# EAGLE design MCU (EAGLE 9.6.0)
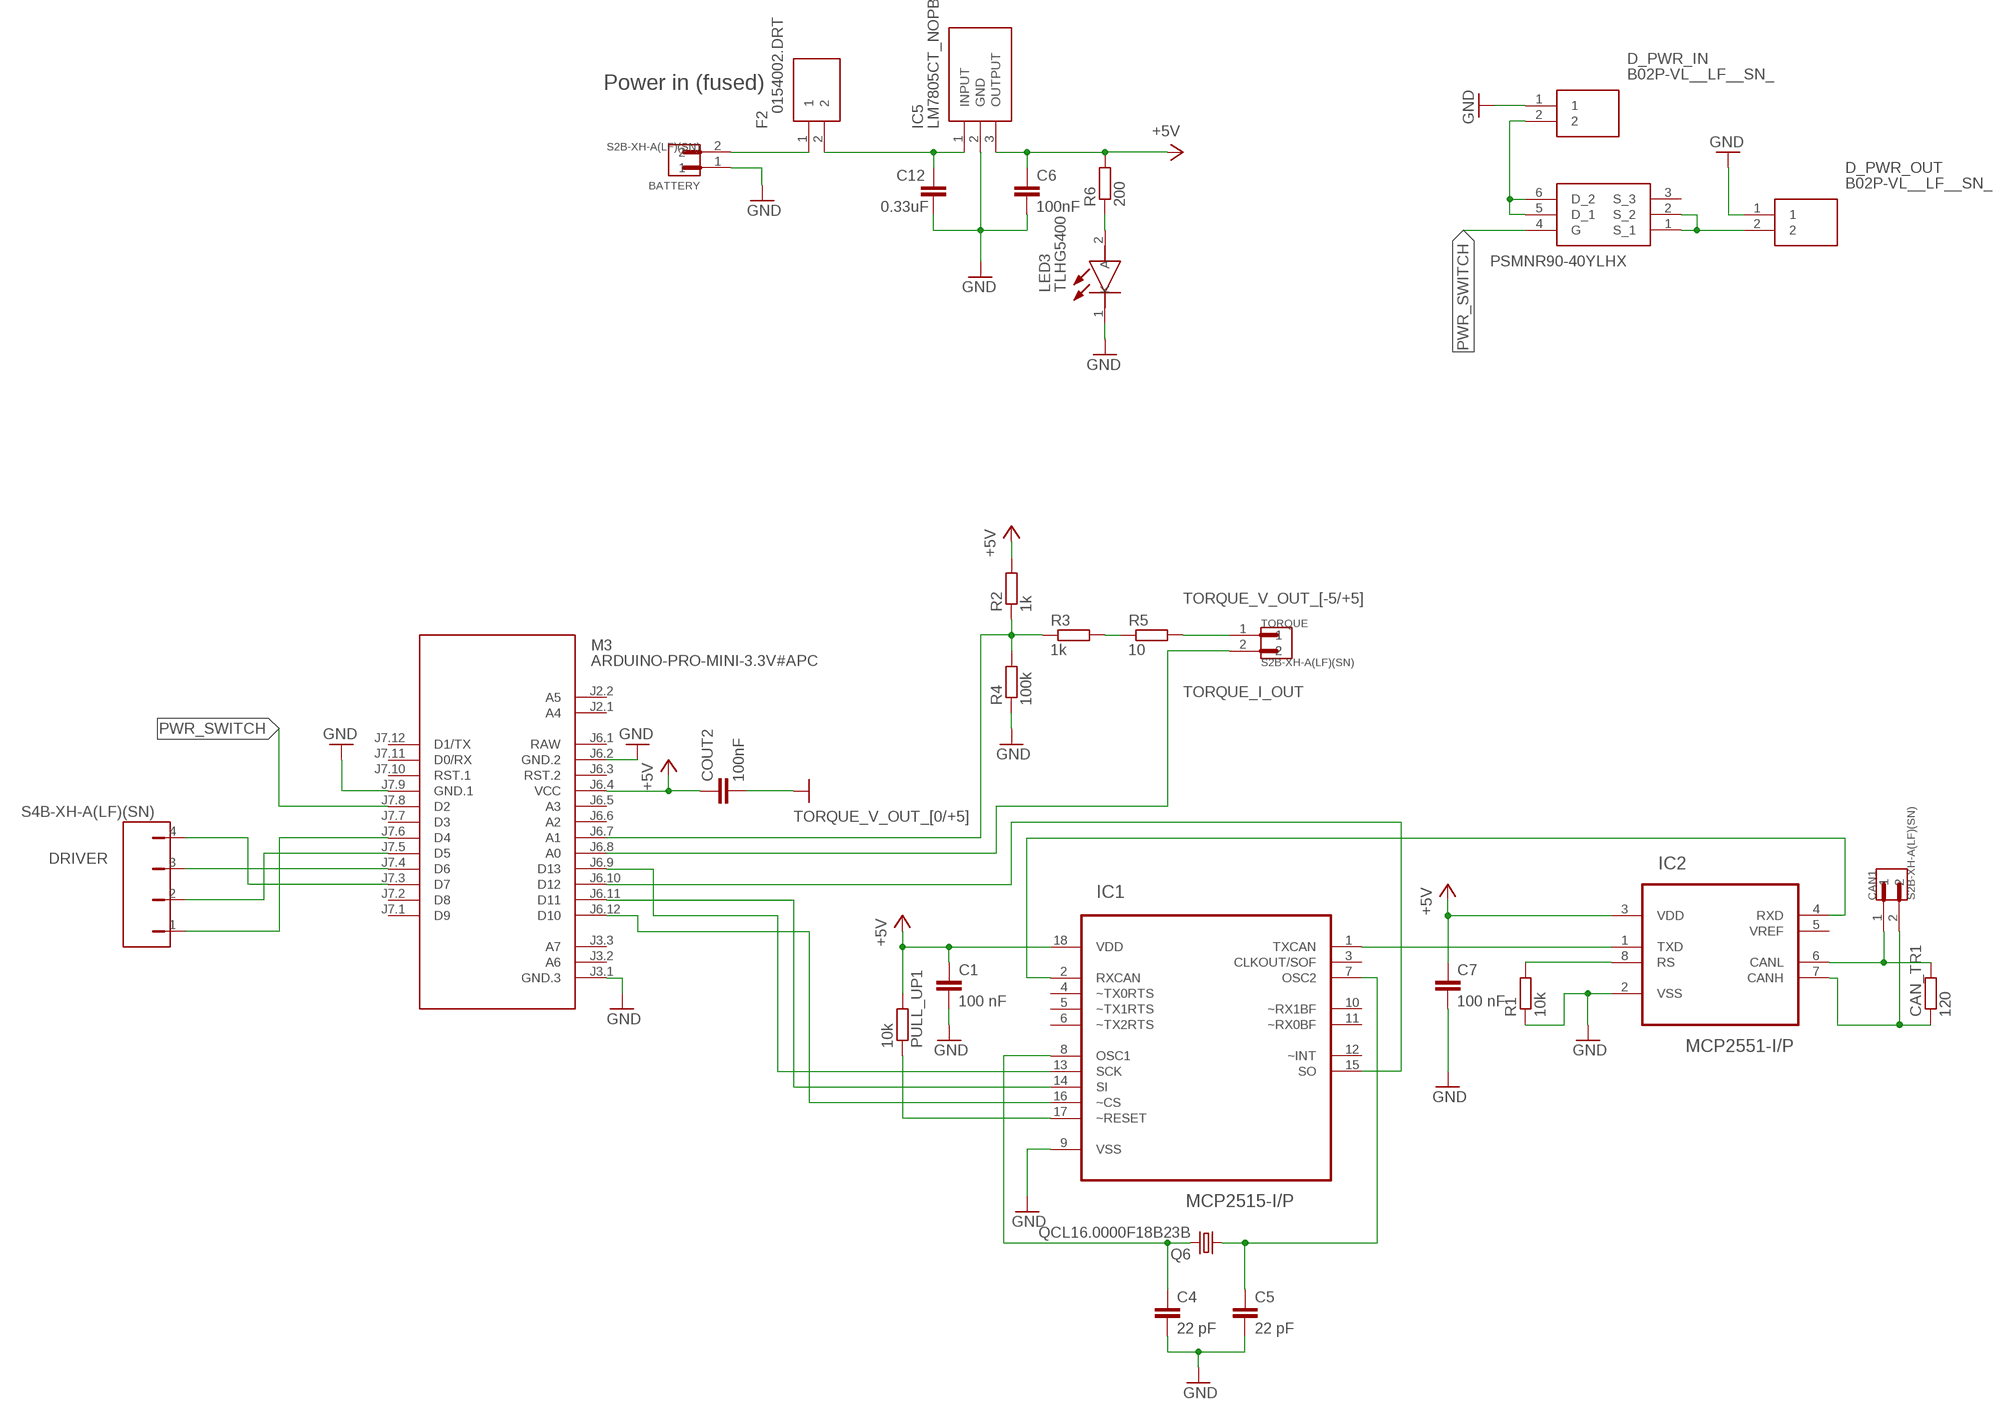
[diagram p0: schematic, sheet 1]

## Parts
BATTERY  S2B-XH-A(LF)(SN)  [JST_S2B-XH-A(LF)(SN)]
C1  100 nF  C-EUC0805  [C0805]
C4  22 pF  C-EUC0805  [C0805]
C5  22 pF  C-EUC0805  [C0805]
C6  100nF  C-EUC0805  [C0805]
C7  100 nF  C-EUC0805  [C0805]
C12  0.33uF  C-EUC0805  [C0805]
CAN1  S2B-XH-A(LF)(SN)  [JST_S2B-XH-A(LF)(SN)]
CAN_TR1  120  R-EU_R0805  [R0805]
COUT2  100nF  C-EUC0805  [C0805]
D_PWR_IN  B02P-VL__LF__SN_  [SHDR2W180P0X620_1X2_1340X1320X]
D_PWR_OUT  B02P-VL__LF__SN_  [SHDR2W180P0X620_1X2_1340X1320X]
DRIVER  S4B-XH-A(LF)(SN)  [S4B-XH-A(LF)(SN)]
F2  0154002.DRT  [FUSM9750X381N]
IC1  MCP2515-I/P  [DIP254P762X432-18]
IC2  MCP2551-I/P  [DIP254P762X432-8]
IC5  LM7805CT_NOPB  [TO254P470X1028X1955-3P]
LED3  TLHG5400  [TLHG5400]
M3  ARDUINO-PRO-MINI-3.3V#APC  [ARDUINO-PRO-MINI#APC]
PULL_UP1  10k  R-EU_R0805  [R0805]
Q1  PSMNR90-40YLHX  [PSMNR9040YLHX]
Q6  QCL16.0000F18B23B  CRYSTALHC49S  [HC49/S]
R1  10k  R-EU_R0805  [R0805]
R2  1k  R-EU_R0805  [R0805]
R3  1k  R-EU_R0805  [R0805]
R4  100k  R-EU_R0805  [R0805]
R5  10  R-EU_R0805  [R0805]
R6  200  R-EU_R0805  [R0805]
TORQUE  S2B-XH-A(LF)(SN)  [JST_S2B-XH-A(LF)(SN)]

## Nets
+5V [signal]: C1.1 C6.1 C7.1 COUT2.1 IC1.18(VDD) IC2.3(VDD) IC5.3(OUTPUT) M3.J6.4(VCC) PULL_UP1.2 R2.2 R6.2
CANH1: CAN1.1 CAN_TR1.2 IC2.6(CANL)
CANL1: CAN1.2 CAN_TR1.1 IC2.7(CANH)
DRAIN [Driver Power]: D_PWR_IN.2 Q1.5(D_1) Q1.6(D_2)
GND: BATTERY.1 C1.2 C4.2 C5.2 C6.2 C7.2 C12.2 COUT2.2 D_PWR_IN.1 D_PWR_OUT.1 IC1.9(VSS) IC2.2(VSS) IC5.2(GND) LED3.1(K) M3.J3.1(GND.3) M3.J6.2(GND.2) M3.J7.9(GND.1) R1.1 R4.1
N$1: DRIVER.4 M3.J7.3(D7)
N$3: DRIVER.2 M3.J7.5(D5)
N$4: C5.1 IC1.7(OSC2) Q6.1
N$8: DRIVER.3 M3.J7.4(D6)
N$9 [signal]: IC1.17(~RESET) PULL_UP1.1
N$11: DRIVER.1 M3.J7.6(D4)
N$16: R3.2 R5.1
N$18: BATTERY.2 F2.1
N$21: LED3.2(A) R6.1
N$24: C12.1 F2.2 IC5.1(INPUT)
N$32: IC1.1(TXCAN) IC2.1(TXD)
N$33: IC1.2(RXCAN) IC2.4(RXD)
N$34: C4.1 IC1.8(OSC1) Q6.2
N$37: IC2.8(RS) R1.2
N$61: IC1.15(SO) M3.J6.10(D12)
N$62: IC1.14(SI) M3.J6.11(D11)
N$63: IC1.16(~CS) M3.J6.12(D10)
N$64: IC1.13(SCK) M3.J6.9(D13)
PWR_SWITCH: M3.J7.8(D2) Q1.4(G)
SOURCE [Driver Power]: D_PWR_OUT.2 Q1.1(S_1) Q1.2(S_2)
TORQUE_I_OUT: M3.J6.8(A0) TORQUE.2
TORQUE_V_OUT_[0/+5]: M3.J6.7(A1) R2.1 R3.1 R4.2
TORQUE_V_OUT_[-5/+5]: R5.2 TORQUE.1
Unconnected: IC1.3(CLKOUT/SOF) IC1.4(~TX0RTS) IC1.5(~TX1RTS) IC1.6(~TX2RTS) IC1.10(~RX1BF) IC1.11(~RX0BF) IC1.12(~INT) IC2.5(VREF) M3.J2.1(A4) M3.J2.2(A5) M3.J3.2(A6) M3.J3.3(A7) M3.J6.3(RST.2) M3.J6.5(A3) M3.J6.6(A2) M3.J7.1(D9) M3.J7.2(D8) M3.J7.7(D3) M3.J7.10(RST.1) M3.J7.11(D0/RX) M3.J7.12(D1/TX) Q1.3(S_3)

## Notes on the sheet
- Power in (fused)

## Power pins joined to a net without a drawn wire
RAW: M3.J6.1(RAW)

## Library data of the parts
BATTERY CAN1 TORQUE = S2B-XH-A_LF__SN_:S2B-XH-A(LF)(SN): XH Series 2.5mm 2 Position Through Hole Shrouded Header Connector; DESCRIPTION: Connector Header Through Hole, Right Angle 2 position 0.098 _2.50mm_; DIGI-KEY_PART_NUMBER: 455-2257-ND; DIGI-KEY_PURCHASE_URL: https://www.digikey.com/product-detail/en/jst-sales-america-inc/S2B-XH-A_LF__SN_/455-2257-ND/1651055?utm_source=snapeda&utm_medium=aggregator&utm_campaign=symbol; MF: JST Sales; MP: S2B-XH-A_LF__SN_; PACKAGE: None
C1 C4-C7 C12 COUT2 = rcl:C-EU: CAPACITOR, European symbol; SPICEPREFIX: C
CAN_TR1 PULL_UP1 R1-R6 = rcl:R-EU_: RESISTOR, European symbol; SPICEPREFIX: R
D_PWR_IN D_PWR_OUT = B02P-VL__LF__SN_:B02P-VL__LF__SN_: JST VL Series, Series Number B02P, 6.2mm Pitch 2 Way 1 Row Straight PCB Header, Through Hole Termination, 20A Source: Datasheet <http://uk.rs-online.com/web/p/products/8201093P>; DESCRIPTION: JST VL Series, Series Number B02P, 6.2mm Pitch 2 Way 1 Row Straight PCB Header, Through Hole Termination, 20A; HEIGHT: 16.4mm; MANUFACTURER_NAME: JST (JAPAN SOLDERLESS TERMINALS); MANUFACTURER_PART_NUMBER: B02P-VL (LF)(SN); RS_PART_NUMBER: 8201093P; RS_PRICE-STOCK: http://uk.rs-online.com/web/p/products/8201093P
DRIVER = S4B-XH-A_LF__SN_:S4B-XH-A(LF)(SN): http://octopart.com/s4b-xh-a%28lf%29%28sn%29-jst-7995347; AVAILABILITY: Unavailable; DESCRIPTION: Connector Header Through Hole, Right Angle 4 position 0.098 _2.50mm_; MF: JST Sales; MP: S4B-XH-A_LF__SN_; PACKAGE: None; PRICE: None
F2 = 0154002.DRT:0154002.DRT: Littelfuse 2A T Surface Mount Fuse, 125V ac/dc Source: Datasheet; DESCRIPTION: Littelfuse 2A T Surface Mount Fuse, 125V ac/dc; HEIGHT: 3.81mm; MANUFACTURER_NAME: LITTELFUSE; MANUFACTURER_PART_NUMBER: 0154002.DRT; MOUSER_PART_NUMBER: 576-0154002.DRT; MOUSER_PRICE-STOCK: https://www.mouser.co.uk/ProductDetail/Littelfuse/0154002DRT?qs=2VFNtWizgicDQ8R7JxIsmA%3D%3D
IC1 = MCP2515-I_P:MCP2515-I/P: Stand-Alone CAN Controller; AVAILABILITY: Unavailable; DESCRIPTION: MCP2515 Series 5.5 V 1 Mb/s Stand Alone SPI Interface CAN Controller - PDIP-18; MF: Microchip; MP: MCP2515-I/P; PACKAGE: DIP-18 Microchip; PRICE: None
IC2 = MCP2551-I_P:MCP2551-I/P: High-Speed CAN Transceiver; AVAILABILITY: Unavailable; DESCRIPTION: MCP2551 Series 5.5 V 1 Mb/s Surface Mount High-Speed CAN Transceiver - PDIP-8; MF: Microchip; MP: MCP2551-I/P; PACKAGE: DIP-8 Microchip; PRICE: None
IC5 = LM7805CT_NOPB:LM7805CT_NOPB: 1.5-A, Wide VIN Fixed Voltage Regulators Source: Datasheet <http://www.ti.com/lit/gpn/lm7800>; DESCRIPTION: 1.5-A, Wide VIN Fixed Voltage Regulators; HEIGHT: 4.7mm; MANUFACTURER_NAME: Texas Instruments; MANUFACTURER_PART_NUMBER: LM7805CT/NOPB; MOUSER_PART_NUMBER: 926-LM7805CT/NOPB; MOUSER_PRICE-STOCK: https://www.mouser.co.uk/ProductDetail/Texas-Instruments/LM7805CT-NOPB?qs=OYMYEaN9QmBS2GvaX6GSkQ%3D%3D
LED3 = TLHG5400:TLHG5400: Vishay TLHG5400, 575 nm Green LED, 5mm (T-1 3/4) Round Through Hole package Source: Datasheet <https://componentsearchengine.com/Datasheets/1/TLHG5400.pdf>; DESCRIPTION: Vishay TLHG5400, 575 nm Green LED, 5mm (T-1 3/4) Round Through Hole package; HEIGHT: 9mm; MANUFACTURER_NAME: Vishay; MANUFACTURER_PART_NUMBER: TLHG5400; MOUSER_PART_NUMBER: 78-TLHG5400; MOUSER_PRICE-STOCK: https://www.mouser.com/Search/Refine.aspx?Keyword=78-TLHG5400
M3 = diy-modules:ARDUINO-PRO-MINI-*#APC: Arduino Pro Mini (and compatible devices) with angle programming connector More details available here: https://www.arduino.cc/en/Main/ArduinoBoardProMini Click here to find device on ebay.com <http://www.ebay.com/sch/arduino+pro+mini>
Q1 = PSMNR90-40YLHX:PSMNR90-40YLHX: MOSFET N-CH 40 V LOGIC LEVEL Source: Datasheet <https://componentsearchengine.com/Datasheets/1/PSMNR90-40YLHX.pdf>; DESCRIPTION: MOSFET N-CH 40 V LOGIC LEVEL; HEIGHT: 1.1mm; MANUFACTURER_NAME: Nexperia; MANUFACTURER_PART_NUMBER: PSMNR90-40YLHX; MOUSER_PART_NUMBER: 771-PSMNR90-40YLHX; MOUSER_PRICE-STOCK: https://www.mouser.com/Search/Refine.aspx?Keyword=771-PSMNR90-40YLHX
Q6 = adafruit:CRYSTAL: CRYSTAL; OC_FARNELL: 1667008; OC_NEWARK: unknown

## Net classes
1 signal: width 0.3 mm, drill 0.4 mm, clearance 0.25 mm
2 12V: width 1 mm, drill 1.1 mm, clearance 0.25 mm
3 Driver Power: width 3 mm, drill 0.4 mm, clearance 0.5 mm

## Board
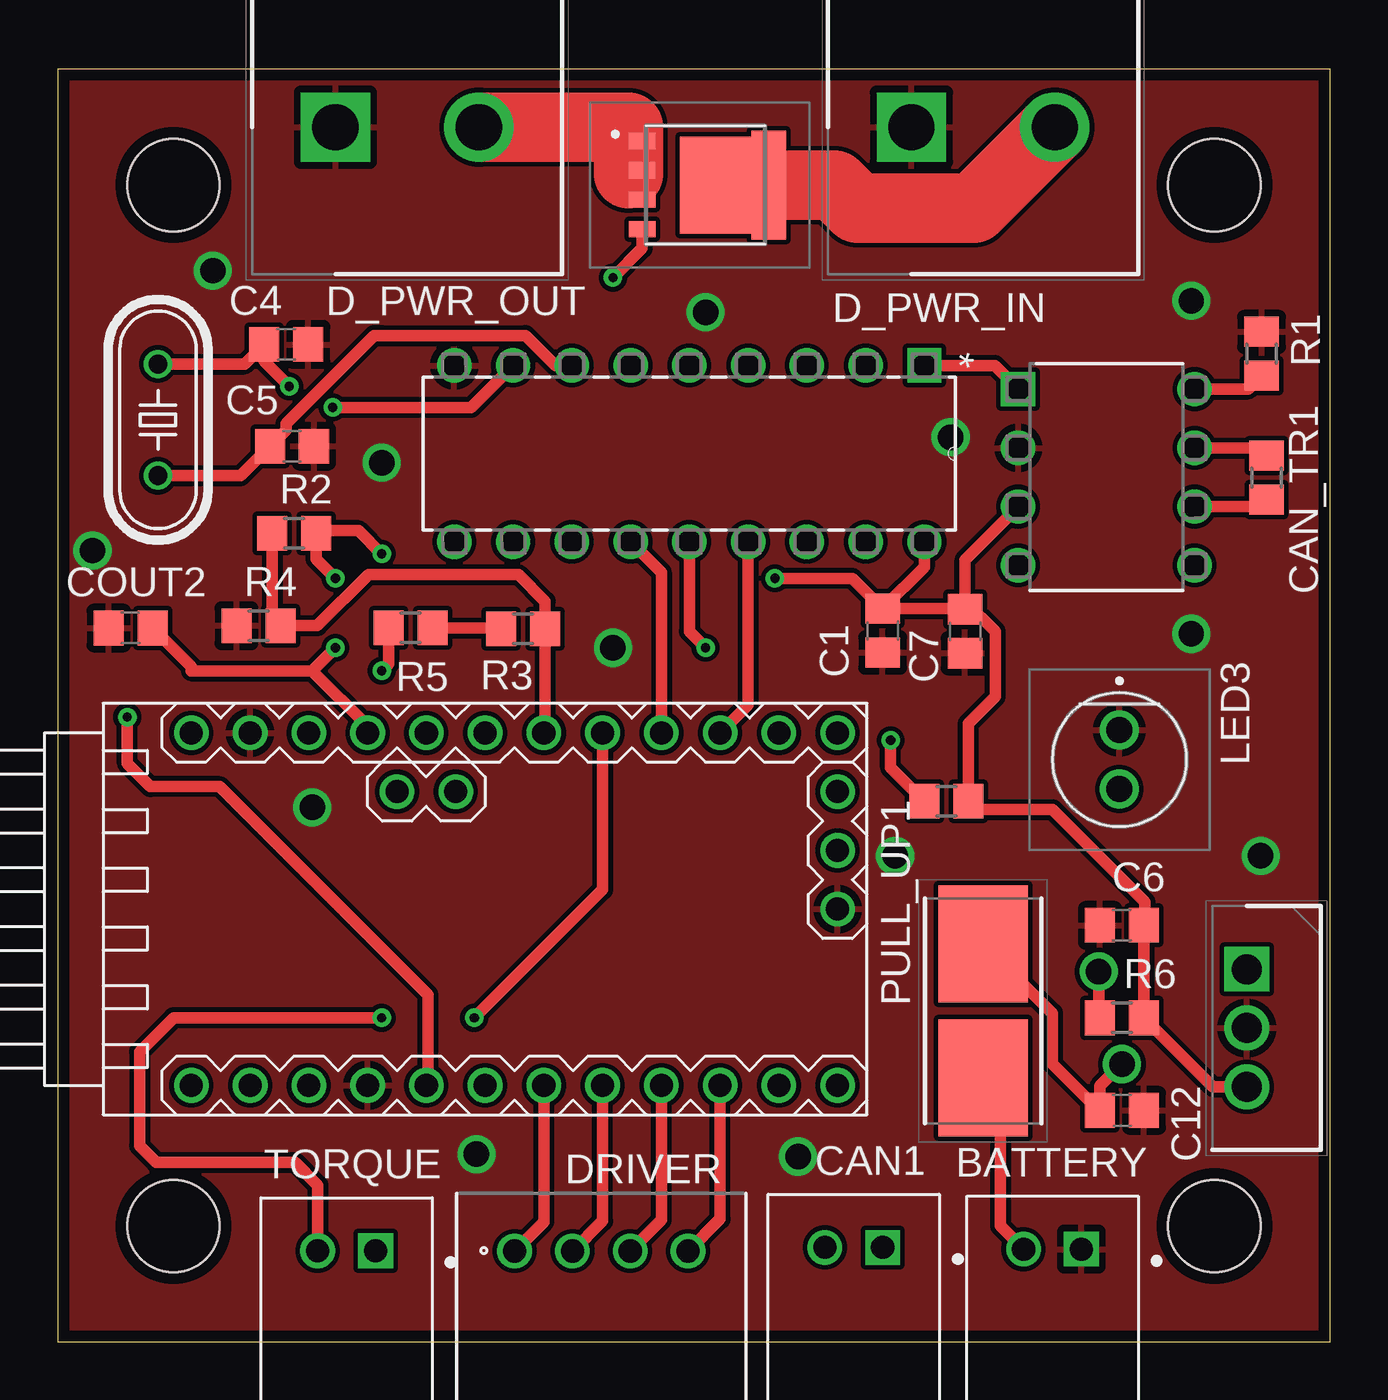
[diagram p1: board, top side]
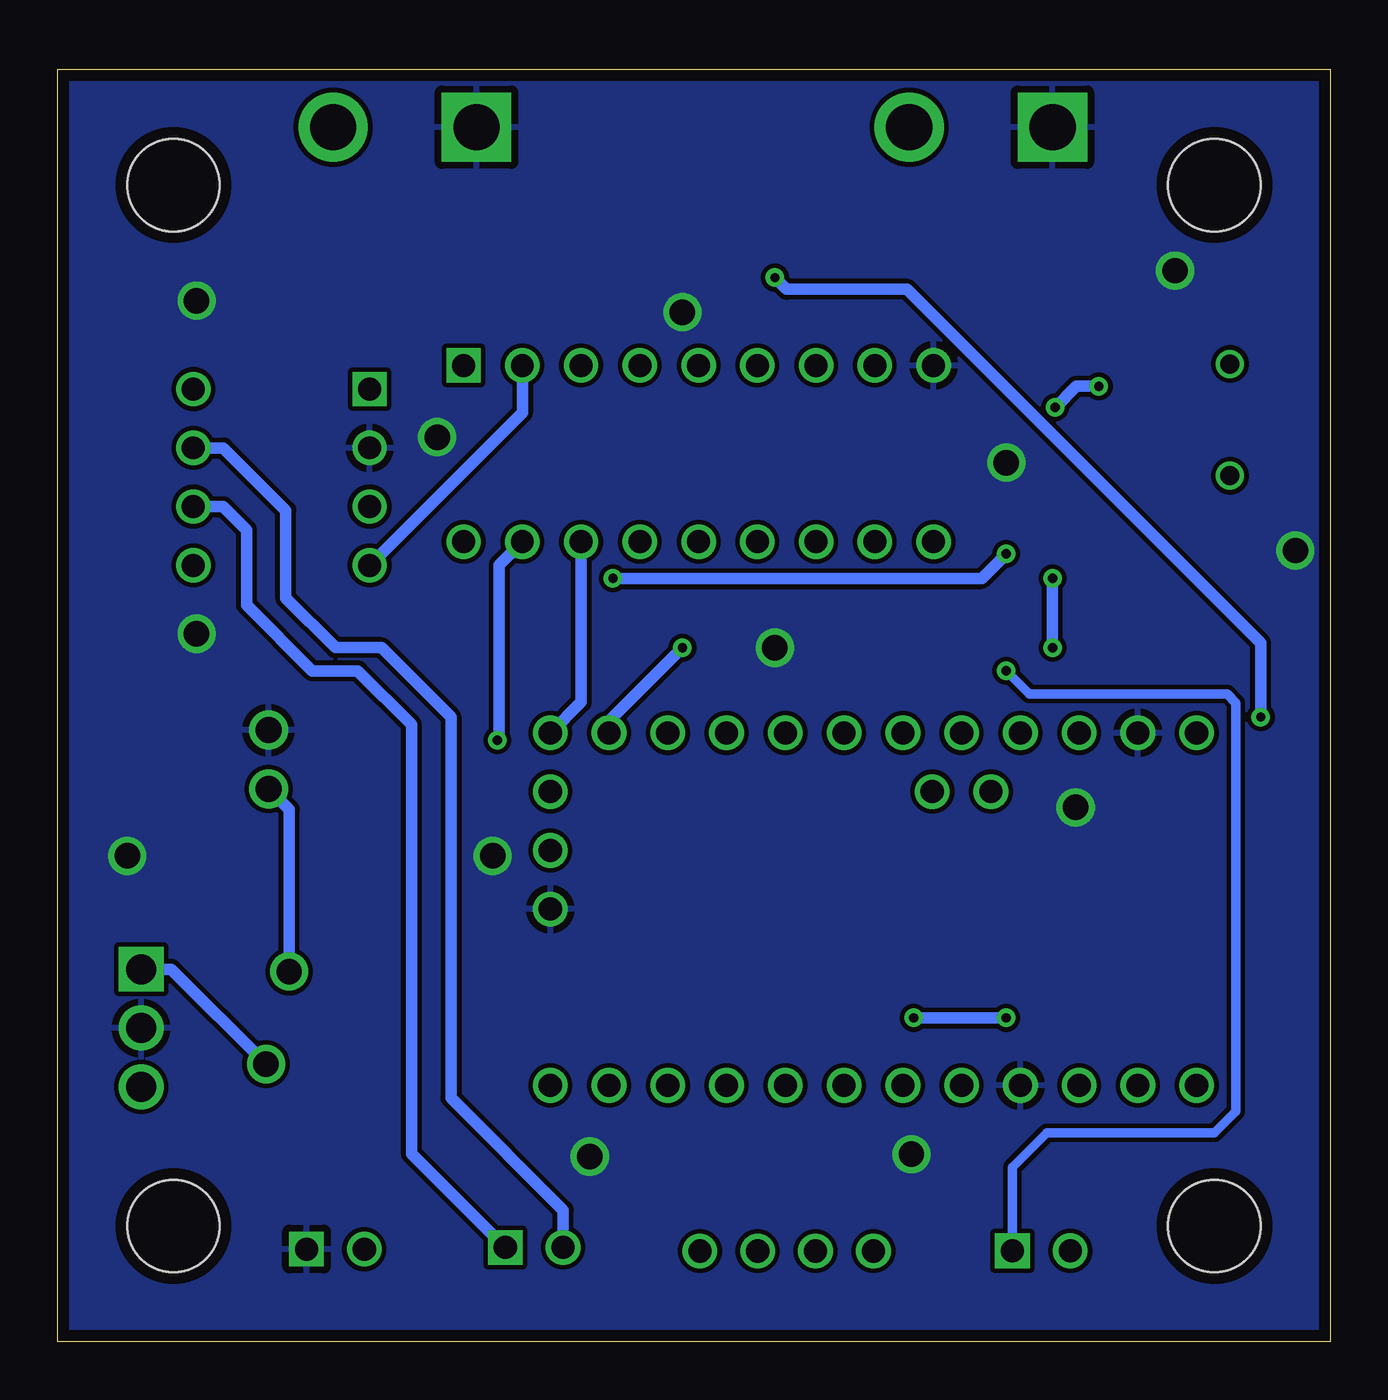
[diagram p2: board, bottom side, seen from below]

Size 55 x 55 mm. Coordinates in mm from the lower left corner, seen from the top.
Outline: 0,0 55,0 55,55 0,55 0,0
Copper layers (1*16): Top 0.035mm / dielectric 1.5mm / Bottom 0.035mm
Design rules "JLC_Vermilion2020": minimum track width 0.2mm, minimum drill 0.3mm, track to track 0.2mm, track to pad 0.3mm, pad to pad 0.3mm, via to via 0.2mm, smd to smd 0.2mm, copper to edge 0.5mm, drill to drill 0.25mm, minimum pad ring 0.2mm, minimum via ring 0.2mm, stop-mask expansion 0.055mm, vias tented up to drill 0.3mm, thermal gap 0.3mm
Holes 4 mm at 5,5 50,5 50,50 5,50

### Footprints (pad centres in the part's own frame; a part is rotated, then mirrored left to right if it is on the bottom)
JST_S2B-XH-A(LF)(SN) = drill 1 square: 1 -1.25,0 | drill 1: 2 1.25,0
C0805 = smd 1.3 x 1.5: 1 -0.95,0; 2 0.95,0
R0805 = smd 1.3 x 1.5: 1 -0.95,0; 2 0.95,0
SHDR2W180P0X620_1X2_1340X1320X = drill 2 pad 3 square: 1 0,0 | drill 2 pad 3: 2 6.2,0
S4B-XH-A(LF)(SN) = drill 1: 1 -0.02,3.75; 2 -0.02,1.25; 3 -0.02,-1.25; 4 -0.02,-3.75
FUSM9750X381N = smd 5.05 x 3.85: 1 -2.9,0; 2 2.9,0
DIP254P762X432-18 = drill 0.991 square: 1 -7.62,20.32 | drill 0.991: 2 -7.62,17.78; 3 -7.62,15.24; 4 -7.62,12.7; 5 -7.62,10.16; 6 -7.62,7.62; 7 -7.62,5.08; 8 -7.62,2.54; 9 -7.62,0; 10 0,0; 11 0,2.54; 12 0,5.08; 13 0,7.62; 14 0,10.16; 15 0,12.7; 16 0,15.24; 17 0,17.78; 18 0,20.32
DIP254P762X432-8 = drill 0.991 square: 1 -7.62,7.62 | drill 0.991: 2 -7.62,5.08; 3 -7.62,2.54; 4 -7.62,0; 5 0,0; 6 0,2.54; 7 0,5.08; 8 0,7.62
TO254P470X1028X1955-3P = drill 1.29 pad 1.935 square: 1 0,0 | drill 1.29 pad 1.935: 2 2.54,0; 3 5.08,0
TLHG5400 = drill 1.12 pad 1.68: 1 1.27,0; 2 -1.27,0
ARDUINO-PRO-MINI#APC = drill 1: J2.1 -1.27,5.08; J2.2 -3.81,5.08; J3.1 15.24,0; J3.2 15.24,2.54; J3.3 15.24,5.08; J6.1 -12.7,7.62; J6.2 -10.16,7.62; J6.3 -7.62,7.62; J6.4 -5.08,7.62; J6.5 -2.54,7.62; J6.6 0,7.62; J6.7 2.54,7.62; J6.8 5.08,7.62; J6.9 7.62,7.62; J6.10 10.16,7.62; J6.11 12.7,7.62; J6.12 15.24,7.62; J7.1 15.24,-7.62; J7.2 12.7,-7.62; J7.3 10.16,-7.62; J7.4 7.62,-7.62; J7.5 5.08,-7.62; J7.6 2.54,-7.62; J7.7 0,-7.62; J7.8 -2.54,-7.62; J7.9 -5.08,-7.62; J7.10 -7.62,-7.62; J7.11 -10.16,-7.62; J7.12 -12.7,-7.62
PSMNR9040YLHX = smd 0.7 x 1.15: 1 -1.905,-2.737; 2 -0.635,-2.737; 3 0.635,-2.737; 4 1.905,-2.737 | smd 4.2 x 3.1: 5 0,0.437 | smd 4.7 x 1.5: 6 0,2.737
HC49/S = drill 0.813: 1 -2.413,0; 2 2.413,0

### Placement (x,y rotation side)
BATTERY  43,4 180 top
C1  35.66,30.74 270 top
C4  9.87,43.11 0 top
C5  10.12,38.71 0 top
C6  46,18 180 top
C7  39.22,30.71 270 top
C12  46,10 0 top
CAN1  34.41,4.07 180 top
CAN_TR1  52.25,37.36 270 top
COUT2  3.15,30.85 180 top
D_PWR_IN  36.9,52.5 0 top
D_PWR_OUT  12,52.5 0 top
DRIVER  23.5,3.94 90 top
F2  40,14.3 90 top
IC1  17.14,34.58 270 top
IC2  49.14,33.56 0 top
IC5  51.4,16.1 270 top
LED3  45.89,25.16 90 top
M3  18.47,18.7 0 top
PULL_UP1  38.41,23.36 0 top
Q1  28,50 270 top
Q6  4.33,39.85 90 top
R1  52.04,42.71 270 top
R2  10.21,34.95 0 top
R3  20.12,30.82 180 top
R4  8.68,30.95 0 top
R5  15.25,30.86 180 top
R6  46,14 0 top
TORQUE  12.48,3.93 180 top

### Tracks (layer width: path | path; a pad name or v marks a point on that pad's centre or on a via)
+5V  (via drill 0.4)
  Top 0.5: IC1.18 37.46,33.5 C1.1 | 39.22,32 C7.1 39.19,31.69 C1.1 | 39.22,32 39.22,33.8 IC2.3 | COUT2.1 5.77,29.18 5.77,29 11,29 | v14,34.06 13,35.06 11.27,35.06 R2.2 11.16,33.84 v12,33 | C1.1 34.35,33 v31,33 | 11,29 v12,30 | 39.22,32 40.52,30.7 40.52,27.88 39.36,26.72 PULL_UP1.2 39.72,23 43,23 47,19 47,18.05 C6.1 R6.2 49.93,11.02 IC5.3 | 11,29 13.39,26.61 M3.J6.4
  Bottom 0.5: v14,34.06 15.06,33 v31,33 | v12,30 v12,33
CANH1
  Top 0.5: IC2.6 51.94,36.1 CAN_TR1.2
  Bottom 0.5: CAN1.1 39.71,8.12 39.71,26.67 42.04,29 44,29 46.85,31.85 46.85,35.1 47.85,36.1 IC2.6
CANL1
  Top 0.5: IC2.7 51.92,38.64 CAN_TR1.1
  Bottom 0.5: CAN1.2 33.16,5.69 38.01,10.54 38.01,27 41.01,30 43,30 45.15,32.15 45.15,35.94 47.85,38.64 IC2.7
DRAIN
  Top 3: D_PWR_IN.2 39.6,49 34.57,49 33.57,50 Q1.6 Q1.5
GND  (via drill 1.1)
  other vias: 28,44.5 24,30 14,38 49,30.6 49,45 52,21 32,8 1.5,34.2 6.7,46.3 38.6,39.1 36.2,21 18.1,8.1 11,23.1
  pour Top: -38,79 -38,-6 -24,-20 74,-20 78,-16 78,78 -37,78
  pour Bottom: -39,79 -39,-11 -40,-12 -30,-22 81,-22 81,80 -38,80
N$1
  Top 0.5: DRIVER.4 28.63,5.3 M3.J7.3
N$3
  Top 0.5: DRIVER.2 23.55,5.22 M3.J7.5
N$4
  Top 0.5: Q6.1 7.9,37.44 C5.1 9.87,39.41 9.87,39.69 13.68,43.49 13.78,43.49 14,43.49 20.22,43.49 21.51,42.2 IC1.7
N$8
  Top 0.5: DRIVER.3 26.09,5.26 M3.J7.4
N$9  (via drill 0.4)
  Top 0.5: PULL_UP1.1 36,24.82 v36,26
  Bottom 0.5: v36,26 35.92,26.08 35.92,33.58 IC1.17
N$11
  Top 0.5: DRIVER.1 21.01,5.18 M3.J7.6
N$16
  Top 0.5: R5.1 19.13,30.86 R3.2
N$18
  Top 0.5: F2.1 40.75,10.65 40.75,5 BATTERY.2
N$21  (via drill 1.1)
  Top 0.5: R6.1 45,14.05 v45,16
  Bottom 0.5: v45,16 45,23 LED3.2
N$24  (via drill 1.1)
  Top 0.5: F2.2 43,14.2 43,12 45,10 C12.1 45.05,11.05 v46,12
  Bottom 0.5: v46,12 50.1,16.1 IC5.1
N$32
  Top 0.5: IC2.1 40.5,42.2 IC1.1
N$33
  Bottom 0.5: IC1.2 34.92,40.16 IC2.4
N$34  (via drill 0.4)
  Top 0.5: Q6.2 8.07,42.26 C4.1 8.92,42.38 v10,41.3 | IC1.8 17.87,40.39 v11.88,40.39
  Bottom 0.5: v11.88,40.39 10.97,41.3 v10,41.3
N$37
  Top 0.5: IC2.8 51.46,41.18 R1.2
N$61
  Top 0.5: IC1.15 29.84,27.53 M3.J6.10
N$62  (via drill 0.4)
  Top 0.5: IC1.14 27.3,30.7 v28,30
  Bottom 0.5: v28,30 31.17,26.83 M3.J6.11
N$63
  Bottom 0.5: IC1.16 32.38,27.65 M3.J6.12
N$64
  Top 0.5: IC1.13 26.09,33.25 M3.J6.9
PWR_SWITCH  (via drill 0.4)
  Top 0.5: M3.J7.8 16,11.15 16,15 7,24 4,24 3,25 v3,27 | Q1.4 25.26,47.26 v24,46
  Bottom 0.5: v3,27 3,30.2 18.29,45.49 23.49,45.49 v24,46
SOURCE
  Top 0.2: 24.67,52.5 Q1.1 Q1.2
  Top 3: D_PWR_OUT.2 24.67,52.5 24.67,50.5
TORQUE_I_OUT  (via drill 0.4)
  Top 0.5: M3.J6.8 23.55,19.55 v18,14 | v14,14 5,14 3.53,12.53 3.53,8.47 4.25,7.75 10.25,7.75 11.23,6.77 TORQUE.2
  Bottom 0.5: v18,14 v14,14
TORQUE_V_OUT_[0/+5]
  Top 0.5: R2.1 9.26,31.31 R4.2 11.22,30.95 13.43,33.16 19.91,33.16 21.07,32 R3.1 21.07,26.38 M3.J6.7
TORQUE_V_OUT_[-5/+5]  (via drill 0.4)
  Top 0.5: R5.2 14.3,29.3 v14,29
  Bottom 0.4: v14,29 13,28 4.45,28 4.07,27.62 4.07,9.96 5,9.03 12.23,9.03 13.73,7.53 TORQUE.1